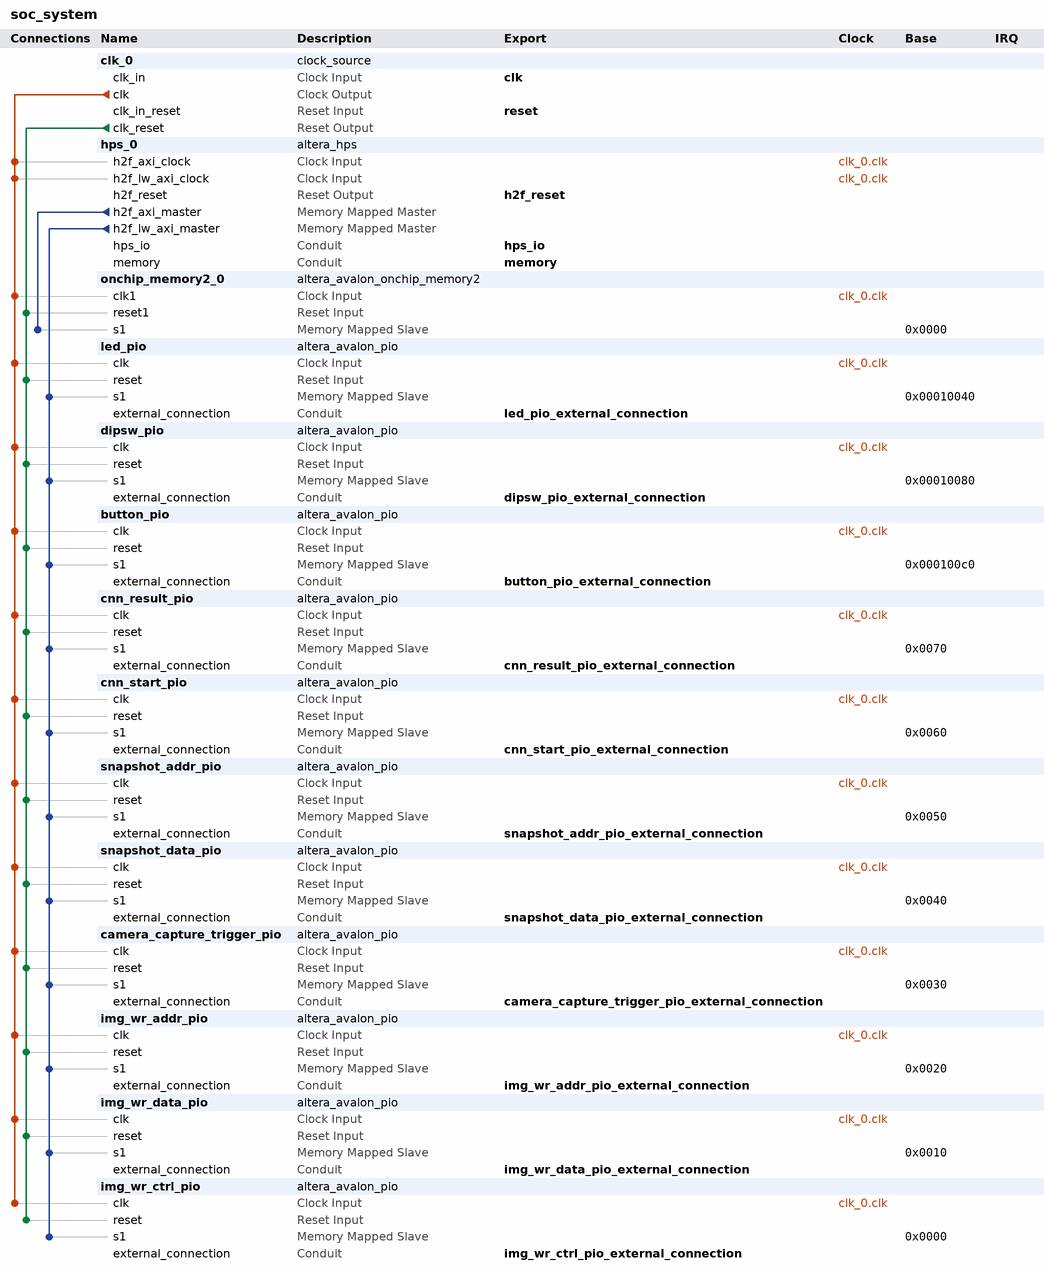
[diagram p0: system contents]
# Platform Designer (Qsys) system soc_system, Cyclone V 5CSEBA6U23I7DK
# Parameters at their usual value, and those the tool derives, are not listed.
package require -exact qsys 25.1
create_system soc_system
set_project_property DEVICE_FAMILY {Cyclone V}
set_project_property DEVICE 5CSEBA6U23I7DK

add_instance clk_0 clock_source 25.1
set_instance_parameter_value clk_0 clockFrequency 50000000

add_instance hps_0 altera_hps 25.1
set_instance_parameter_value hps_0 EMAC1_Mode RGMII
set_instance_parameter_value hps_0 EMAC1_PinMuxing {HPS I/O Set 0}
set_instance_parameter_value hps_0 F2SCLK_COLDRST_Enable false
set_instance_parameter_value hps_0 F2SCLK_DBGRST_Enable false
set_instance_parameter_value hps_0 F2SCLK_WARMRST_Enable false
set_instance_parameter_value hps_0 F2SINTERRUPT_Enable false
set_instance_parameter_value hps_0 F2S_Width 0
set_instance_parameter_value hps_0 FPGA_PERIPHERAL_OUTPUT_CLOCK_FREQ_EMAC0_GTX_CLK 125
set_instance_parameter_value hps_0 FPGA_PERIPHERAL_OUTPUT_CLOCK_FREQ_EMAC0_MD_CLK 2.5
set_instance_parameter_value hps_0 FPGA_PERIPHERAL_OUTPUT_CLOCK_FREQ_EMAC1_GTX_CLK 125
set_instance_parameter_value hps_0 FPGA_PERIPHERAL_OUTPUT_CLOCK_FREQ_EMAC1_MD_CLK 2.5
set_instance_parameter_value hps_0 HPS_PROTOCOL DDR3
set_instance_parameter_value hps_0 I2C0_Mode I2C
set_instance_parameter_value hps_0 I2C0_PinMuxing {HPS I/O Set 0}
set_instance_parameter_value hps_0 I2C1_Mode I2C
set_instance_parameter_value hps_0 I2C1_PinMuxing {HPS I/O Set 0}
set_instance_parameter_value hps_0 LWH2F_Enable true
set_instance_parameter_value hps_0 MEM_BANKADDR_WIDTH 3
set_instance_parameter_value hps_0 MEM_CLK_FREQ 400.0
set_instance_parameter_value hps_0 MEM_COL_ADDR_WIDTH 10
set_instance_parameter_value hps_0 MEM_DQ_WIDTH 32
set_instance_parameter_value hps_0 MEM_DRV_STR RZQ/6
set_instance_parameter_value hps_0 MEM_ROW_ADDR_WIDTH 15
set_instance_parameter_value hps_0 MEM_RTT_NOM RZQ/6
set_instance_parameter_value hps_0 MEM_RTT_WR {Dynamic ODT off}
set_instance_parameter_value hps_0 MEM_TCL 7
set_instance_parameter_value hps_0 MEM_TFAW_NS 37.5
set_instance_parameter_value hps_0 MEM_TRAS_NS 35.0
set_instance_parameter_value hps_0 MEM_TRCD_NS 13.75
set_instance_parameter_value hps_0 MEM_TRFC_NS 300.0
set_instance_parameter_value hps_0 MEM_TRP_NS 13.75
set_instance_parameter_value hps_0 MEM_VENDOR Other
set_instance_parameter_value hps_0 MEM_WTCL 7
set_instance_parameter_value hps_0 QSPI_Mode N/A
set_instance_parameter_value hps_0 QSPI_PinMuxing Unused
set_instance_parameter_value hps_0 REF_CLK_FREQ 25.0
set_instance_parameter_value hps_0 S2FCLK_USER2CLK 5
set_instance_parameter_value hps_0 S2F_Width 2
set_instance_parameter_value hps_0 SDIO_Mode {4-bit Data}
set_instance_parameter_value hps_0 SDIO_PinMuxing {HPS I/O Set 0}
set_instance_parameter_value hps_0 SPIM1_Mode {Single Slave Select}
set_instance_parameter_value hps_0 SPIM1_PinMuxing {HPS I/O Set 0}
set_instance_parameter_value hps_0 STM_Enable false
set_instance_parameter_value hps_0 TIMING_BOARD_AC_SKEW 0.02
set_instance_parameter_value hps_0 TIMING_BOARD_AC_TO_CK_SKEW 0.0
set_instance_parameter_value hps_0 TIMING_BOARD_DQ_TO_DQS_SKEW 0.0
set_instance_parameter_value hps_0 TIMING_BOARD_MAX_CK_DELAY 0.6
set_instance_parameter_value hps_0 TIMING_BOARD_MAX_DQS_DELAY 0.6
set_instance_parameter_value hps_0 TIMING_BOARD_SKEW_BETWEEN_DQS 0.02
set_instance_parameter_value hps_0 TIMING_BOARD_SKEW_CKDQS_DIMM_MAX 0.01
set_instance_parameter_value hps_0 TIMING_BOARD_SKEW_CKDQS_DIMM_MIN -0.01
set_instance_parameter_value hps_0 TIMING_BOARD_SKEW_WITHIN_DQS 0.02
set_instance_parameter_value hps_0 TIMING_TDH 125
set_instance_parameter_value hps_0 TIMING_TDQSCK 400
set_instance_parameter_value hps_0 TIMING_TDQSQ 120
set_instance_parameter_value hps_0 TIMING_TDS 50
set_instance_parameter_value hps_0 TIMING_TIH 250
set_instance_parameter_value hps_0 TIMING_TIS 175
set_instance_parameter_value hps_0 TIMING_TQSH 0.38
set_instance_parameter_value hps_0 UART0_Mode {No Flow Control}
set_instance_parameter_value hps_0 UART0_PinMuxing {HPS I/O Set 0}
set_instance_parameter_value hps_0 USB1_Mode SDR
set_instance_parameter_value hps_0 USB1_PinMuxing {HPS I/O Set 0}
set_instance_parameter_value hps_0 desired_cfg_clk_mhz 100.0
set_instance_parameter_value hps_0 desired_qspi_clk_mhz 400.0

add_instance onchip_memory2_0 altera_avalon_onchip_memory2 25.1
set_instance_parameter_value onchip_memory2_0 dataWidth 8
set_instance_parameter_value onchip_memory2_0 dualPort false
set_instance_parameter_value onchip_memory2_0 initMemContent true
set_instance_parameter_value onchip_memory2_0 initializationFileName onchip_mem.hex
set_instance_parameter_value onchip_memory2_0 memorySize 4096

add_instance led_pio altera_avalon_pio 25.1
set_instance_parameter_value led_pio bitModifyingOutReg true
set_instance_parameter_value led_pio direction InOut
set_instance_parameter_value led_pio width 8

add_instance dipsw_pio altera_avalon_pio 25.1
set_instance_parameter_value dipsw_pio bitClearingEdgeCapReg true
set_instance_parameter_value dipsw_pio captureEdge true
set_instance_parameter_value dipsw_pio direction Input
set_instance_parameter_value dipsw_pio edgeType ANY
set_instance_parameter_value dipsw_pio width 4

add_instance button_pio altera_avalon_pio 25.1
set_instance_parameter_value button_pio bitClearingEdgeCapReg true
set_instance_parameter_value button_pio captureEdge true
set_instance_parameter_value button_pio direction Input
set_instance_parameter_value button_pio edgeType FALLING
set_instance_parameter_value button_pio width 2

add_instance cnn_result_pio altera_avalon_pio 25.1
set_instance_parameter_value cnn_result_pio direction Input
set_instance_parameter_value cnn_result_pio width 32

add_instance cnn_start_pio altera_avalon_pio 25.1
set_instance_parameter_value cnn_start_pio direction Output
set_instance_parameter_value cnn_start_pio width 1

add_instance snapshot_addr_pio altera_avalon_pio 25.1
set_instance_parameter_value snapshot_addr_pio direction Output
set_instance_parameter_value snapshot_addr_pio width 14

add_instance snapshot_data_pio altera_avalon_pio 25.1
set_instance_parameter_value snapshot_data_pio direction Input
set_instance_parameter_value snapshot_data_pio width 16

add_instance camera_capture_trigger_pio altera_avalon_pio 25.1
set_instance_parameter_value camera_capture_trigger_pio direction Output
set_instance_parameter_value camera_capture_trigger_pio width 1

add_instance img_wr_addr_pio altera_avalon_pio 25.1
set_instance_parameter_value img_wr_addr_pio direction Output
set_instance_parameter_value img_wr_addr_pio width 14

add_instance img_wr_data_pio altera_avalon_pio 25.1
set_instance_parameter_value img_wr_data_pio direction Output
set_instance_parameter_value img_wr_data_pio width 16

add_instance img_wr_ctrl_pio altera_avalon_pio 25.1
set_instance_parameter_value img_wr_ctrl_pio direction Output
set_instance_parameter_value img_wr_ctrl_pio width 4

# connections
add_connection clk_0.clk button_pio.clk clock
add_connection clk_0.clk camera_capture_trigger_pio.clk clock
add_connection clk_0.clk cnn_result_pio.clk clock
add_connection clk_0.clk cnn_start_pio.clk clock
add_connection clk_0.clk dipsw_pio.clk clock
add_connection clk_0.clk hps_0.h2f_axi_clock clock
add_connection clk_0.clk hps_0.h2f_lw_axi_clock clock
add_connection clk_0.clk img_wr_addr_pio.clk clock
add_connection clk_0.clk img_wr_ctrl_pio.clk clock
add_connection clk_0.clk img_wr_data_pio.clk clock
add_connection clk_0.clk led_pio.clk clock
add_connection clk_0.clk onchip_memory2_0.clk1 clock
add_connection clk_0.clk snapshot_addr_pio.clk clock
add_connection clk_0.clk snapshot_data_pio.clk clock
add_connection clk_0.clk_reset button_pio.reset reset
add_connection clk_0.clk_reset camera_capture_trigger_pio.reset reset
add_connection clk_0.clk_reset cnn_result_pio.reset reset
add_connection clk_0.clk_reset cnn_start_pio.reset reset
add_connection clk_0.clk_reset dipsw_pio.reset reset
add_connection clk_0.clk_reset img_wr_addr_pio.reset reset
add_connection clk_0.clk_reset img_wr_ctrl_pio.reset reset
add_connection clk_0.clk_reset img_wr_data_pio.reset reset
add_connection clk_0.clk_reset led_pio.reset reset
add_connection clk_0.clk_reset onchip_memory2_0.reset1 reset
add_connection clk_0.clk_reset snapshot_addr_pio.reset reset
add_connection clk_0.clk_reset snapshot_data_pio.reset reset
add_connection hps_0.h2f_axi_master onchip_memory2_0.s1 avalon
set_connection_parameter_value hps_0.h2f_axi_master/onchip_memory2_0.s1 baseAddress 0x0000
add_connection hps_0.h2f_lw_axi_master button_pio.s1 avalon
set_connection_parameter_value hps_0.h2f_lw_axi_master/button_pio.s1 baseAddress 0x000100c0
add_connection hps_0.h2f_lw_axi_master camera_capture_trigger_pio.s1 avalon
set_connection_parameter_value hps_0.h2f_lw_axi_master/camera_capture_trigger_pio.s1 baseAddress 0x0030
add_connection hps_0.h2f_lw_axi_master cnn_result_pio.s1 avalon
set_connection_parameter_value hps_0.h2f_lw_axi_master/cnn_result_pio.s1 baseAddress 0x0070
add_connection hps_0.h2f_lw_axi_master cnn_start_pio.s1 avalon
set_connection_parameter_value hps_0.h2f_lw_axi_master/cnn_start_pio.s1 baseAddress 0x0060
add_connection hps_0.h2f_lw_axi_master dipsw_pio.s1 avalon
set_connection_parameter_value hps_0.h2f_lw_axi_master/dipsw_pio.s1 baseAddress 0x00010080
add_connection hps_0.h2f_lw_axi_master img_wr_addr_pio.s1 avalon
set_connection_parameter_value hps_0.h2f_lw_axi_master/img_wr_addr_pio.s1 baseAddress 0x0020
add_connection hps_0.h2f_lw_axi_master img_wr_ctrl_pio.s1 avalon
set_connection_parameter_value hps_0.h2f_lw_axi_master/img_wr_ctrl_pio.s1 baseAddress 0x0000
add_connection hps_0.h2f_lw_axi_master img_wr_data_pio.s1 avalon
set_connection_parameter_value hps_0.h2f_lw_axi_master/img_wr_data_pio.s1 baseAddress 0x0010
add_connection hps_0.h2f_lw_axi_master led_pio.s1 avalon
set_connection_parameter_value hps_0.h2f_lw_axi_master/led_pio.s1 baseAddress 0x00010040
add_connection hps_0.h2f_lw_axi_master snapshot_addr_pio.s1 avalon
set_connection_parameter_value hps_0.h2f_lw_axi_master/snapshot_addr_pio.s1 baseAddress 0x0050
add_connection hps_0.h2f_lw_axi_master snapshot_data_pio.s1 avalon
set_connection_parameter_value hps_0.h2f_lw_axi_master/snapshot_data_pio.s1 baseAddress 0x0040

# exported interfaces
add_interface button_pio_external_connection conduit end
set_interface_property button_pio_external_connection EXPORT_OF button_pio.external_connection
add_interface camera_capture_trigger_pio_external_connection conduit end
set_interface_property camera_capture_trigger_pio_external_connection EXPORT_OF camera_capture_trigger_pio.external_connection
add_interface clk clock sink
set_interface_property clk EXPORT_OF clk_0.clk_in
add_interface cnn_result_pio_external_connection conduit end
set_interface_property cnn_result_pio_external_connection EXPORT_OF cnn_result_pio.external_connection
add_interface cnn_start_pio_external_connection conduit end
set_interface_property cnn_start_pio_external_connection EXPORT_OF cnn_start_pio.external_connection
add_interface dipsw_pio_external_connection conduit end
set_interface_property dipsw_pio_external_connection EXPORT_OF dipsw_pio.external_connection
add_interface h2f_reset reset source
set_interface_property h2f_reset EXPORT_OF hps_0.h2f_reset
add_interface hps_io conduit end
set_interface_property hps_io EXPORT_OF hps_0.hps_io
add_interface img_wr_addr_pio_external_connection conduit end
set_interface_property img_wr_addr_pio_external_connection EXPORT_OF img_wr_addr_pio.external_connection
add_interface img_wr_ctrl_pio_external_connection conduit end
set_interface_property img_wr_ctrl_pio_external_connection EXPORT_OF img_wr_ctrl_pio.external_connection
add_interface img_wr_data_pio_external_connection conduit end
set_interface_property img_wr_data_pio_external_connection EXPORT_OF img_wr_data_pio.external_connection
add_interface led_pio_external_connection conduit end
set_interface_property led_pio_external_connection EXPORT_OF led_pio.external_connection
add_interface memory conduit end
set_interface_property memory EXPORT_OF hps_0.memory
add_interface reset reset sink
set_interface_property reset EXPORT_OF clk_0.clk_in_reset
add_interface snapshot_addr_pio_external_connection conduit end
set_interface_property snapshot_addr_pio_external_connection EXPORT_OF snapshot_addr_pio.external_connection
add_interface snapshot_data_pio_external_connection conduit end
set_interface_property snapshot_data_pio_external_connection EXPORT_OF snapshot_data_pio.external_connection

set_interconnect_requirement {$system} qsys_mm.clockCrossingAdapter HANDSHAKE
set_interconnect_requirement {$system} qsys_mm.enableEccProtection FALSE
set_interconnect_requirement {$system} qsys_mm.insertDefaultSlave FALSE
set_interconnect_requirement {$system} qsys_mm.maxAdditionalLatency 1

save_system soc_system.qsys
